# Altium schematic sheet Controller.SchDoc
size A4
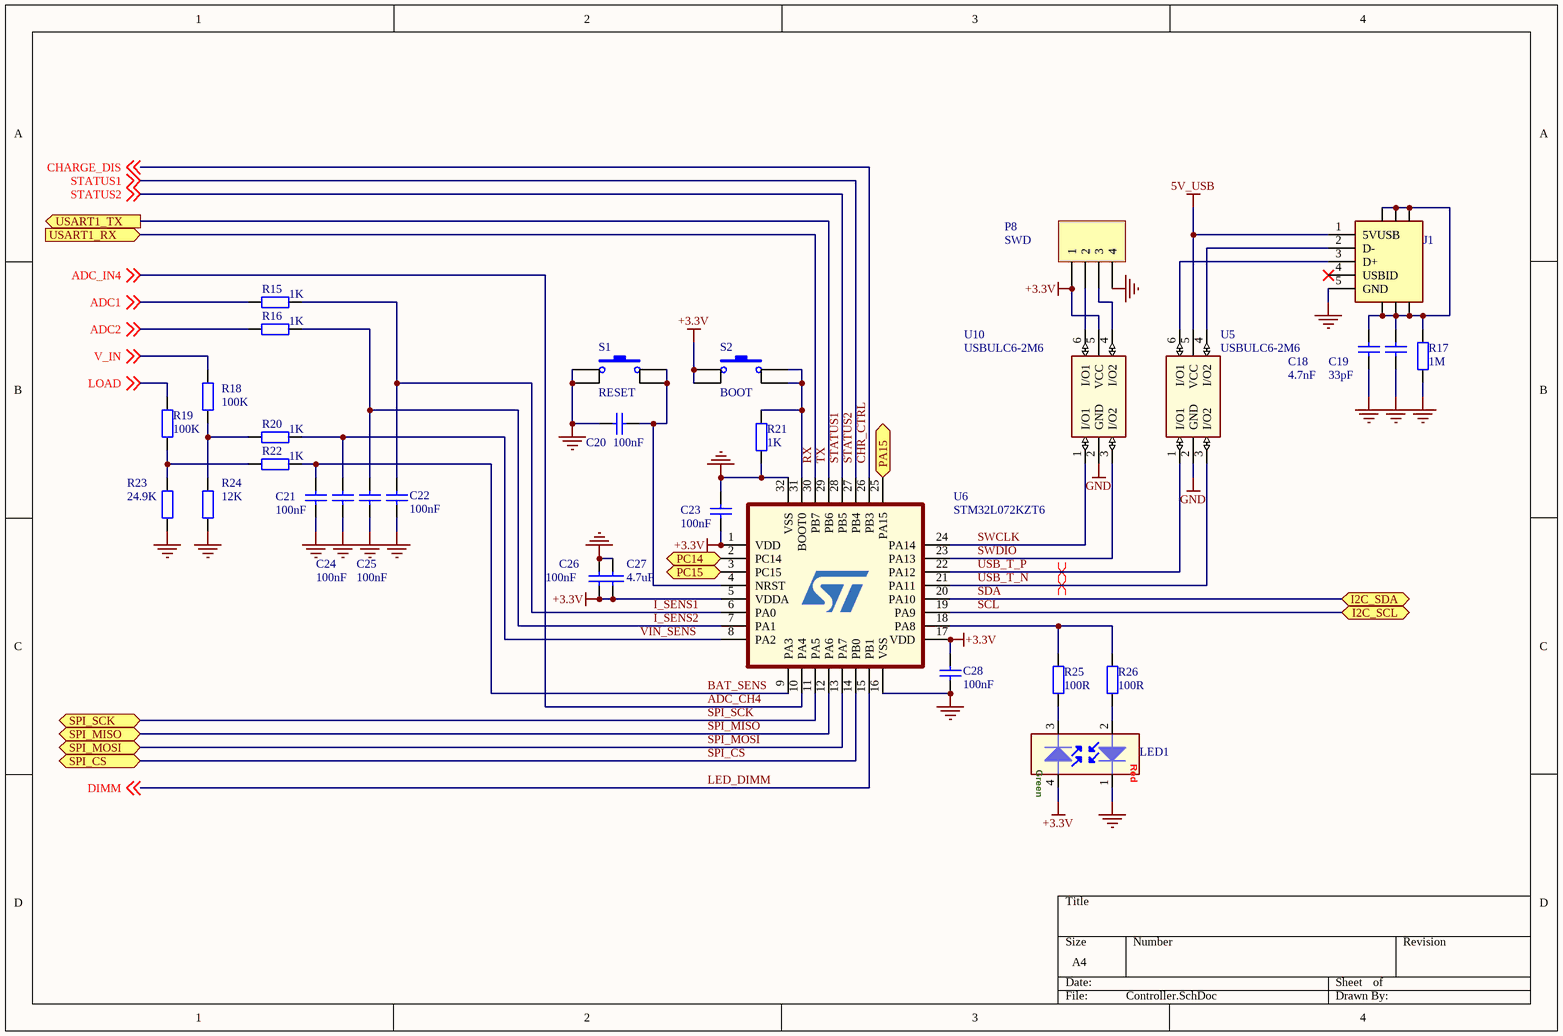
[diagram p0: Controller.SchDoc]

## Parts
C18  value 4.7nF  [C0402]  (hidden comment: Capacitor ceramic)
C19  value 33pF  [C0402]  (hidden comment: Capacitor ceramic)
C20  value 100nF  [C0402]  (hidden comment: Capacitor ceramic)
C21  value 100nF  [C0402]  (hidden comment: Capacitor ceramic)
C22  value 100nF  [C0402]  (hidden comment: Capacitor ceramic)
C23  value 100nF  [C0402]  (hidden comment: Capacitor ceramic)
C24  value 100nF  [C0402]  (hidden comment: Capacitor ceramic)
C25  value 100nF  [C0402]  (hidden comment: Capacitor ceramic)
C26  value 100nF  [C0402]  (hidden comment: Capacitor ceramic)
C27  value 4.7uF  [C0805]  (hidden comment: Capacitor ceramic)
C28  value 100nF  [C0402]  (hidden comment: Capacitor ceramic)
J1  CON-000116-01  [10118192-0001LF]  (value not drawn)
LED1  LED_BICOLOR  [PLCC-4]  (value not drawn)
P8  SWD  [HDR1X4]  (no BOM)
R15  value 1K  [R0402]  (hidden comment: Resistor)
R16  value 1K  [R0402]  (hidden comment: Resistor)
R17  value 1M  [R0402]  (hidden comment: Resistor)
R18  value 100K  [R0402]  (hidden comment: Resistor)
R19  value 100K  [R0402]  (hidden comment: Resistor)
R20  value 1K  [R0402]  (hidden comment: Resistor)
R21  value 1K  [R0402]  (hidden comment: Resistor)
R22  value 1K  [R0402]  (hidden comment: Resistor)
R23  value 24.9K  [R0402]  (hidden comment: Resistor)
R24  value 12K  [R0402]  (hidden comment: Resistor)
R25  value 100R  [R0402]  (hidden comment: Resistor)
R26  value 100R  [R0402]  (hidden comment: Resistor)
S1  RESET  [EVQPUA]
S2  BOOT  [EVQPUA]
U5  USBULC6-2M6  [Micro_QFN_6L]
U6  STM32L072KZT6  [LQFP32]
U10  USBULC6-2M6  [Micro_QFN_6L]

## Ports
I2C_SCL (bidir), I2C_SDA (bidir), PA15 (bidir), PC14 (bidir), PC15 (bidir), SPI_CS (bidir), SPI_MISO (bidir), SPI_MOSI (bidir), SPI_SCK (bidir), USART1_RX (in), USART1_TX (out)

## Nets
5V_USB: J1.1(5VUSB) U5.5(VCC)
+3.3V: C23.2 C26.2 C27.1 C28.1 LED1.4 P8.1 S2.1 S2.3 U6.1(VDD) U6.5(VDDA) U6.17(VDD) U10.5(VCC)
GND: C18.1 C19.1 C20.2 C21.2 C22.2 C23.1 C24.2 C25.2 C26.1 C27.2 C28.2 J1.5(GND) LED1.1 P8.4 R17.1 R21.1 R23.2 R24.1 S1.1 S1.3 U5.2(GND) U6.16(VSS) U6.32(VSS) U10.2(GND)
ADC1: R15.1 ; off-sheet ADC1
ADC2: R16.1 ; off-sheet ADC2
ADC_CH4: U6.10(PA4) ; off-sheet ADC_IN4  [also labelled ADC_IN4]
BAT_SENS: C21.1 R22.2 U6.9(PA3)
CHR_CTRL: U6.26(PB3) ; off-sheet CHARGE_DIS  [also labelled CHARGE_DIS]
I_SENS1: C22.1 R15.2 U6.6(PA0)
I_SENS2: C25.1 R16.2 U6.7(PA1)
LED_DIMM: U6.15(PB1) ; off-sheet DIMM  [also labelled DIMM]
LOAD: R19.1 ; off-sheet LOAD
PA15: U6.25(PA15) ; port PA15
PC14: U6.2(PC14) ; port PC14
PC15: U6.3(PC15) ; port PC15
RX: U6.30(PB7) ; port USART1_RX
SCL: U6.19(PA9) ; port I2C_SCL
SDA: U6.20(PA10) ; port I2C_SDA
SPI_CS: U6.14(PB0) ; port SPI_CS
SPI_MISO: U6.12(PA6) ; port SPI_MISO
SPI_MOSI: U6.13(PA7) ; port SPI_MOSI
SPI_SCK: U6.11(PA5) ; port SPI_SCK
STATUS1: U6.27(PB4) U6.28(PB5) ; off-sheet STATUS1, off-sheet STATUS2  [also labelled STATUS2]
SWCLK: U6.24(PA14) U10.1(I/O1)
SWDIO: U6.23(PA13) U10.3(I/O2)
TX: U6.29(PB6) ; port USART1_TX
USB_T_N: U5.3(I/O2) U6.21(PA11)
USB_T_P: U5.1(I/O1) U6.22(PA12)
V_IN: R18.2 ; off-sheet V_IN
VIN_SENS: C24.1 R20.2 U6.8(PA2)
NetC18_2: C18.2 C19.2 J1.6 J1.7 J1.8 J1.9 J1.10 J1.11 R17.2
NetC20_1: C20.1 S1.2 S1.4 U6.4(NRST)
NetJ1_2: J1.2(D-) U5.4(I/O2)
NetJ1_3: J1.3(D+) U5.6(I/O1)
NetLED1_2: LED1.2 R26.2
NetLED1_3: LED1.3 R25.2
NetP8_2: P8.2 U10.6(I/O1)
NetP8_3: P8.3 U10.4(I/O2)
NetR18_1: R18.1 R20.1 R24.2
NetR19_2: R19.2 R22.1 R23.1
NetR21_2: R21.2 S2.2 S2.4 U6.31(BOOT0)
NetR25_1: R25.1 R26.1 U6.18(PA8)

Not connected (* = marked no-connect by the designer): J1 4(USBID)*

## Layout directives
differential pair: USB_T_N, USB_T_P

## Notes on the sheet
- (in symbol LED_BICOLOR) Red; Green

## Library data of the parts
C18 = Cap Semi: Manufacturer: Yageo; Manufacturer Part No.: AC0402KRX7R9BB472; Part Description: Ceramic Capacitor; Specification: X7R, 50V, 10%; Supplier: DigiKey; Supplier part number: 311-3030-1-ND; Link: https://www.digikey.com/product-detail/en/yageo/AC0402KRX7R9BB472/311-3030-1-ND/6643281
C19 = Cap Semi: Manufacturer: Yageo; Manufacturer Part No.: CC0402JRNPO9BN330; Part Description: Ceramic Capacitor; Specification: NP0, 50V, 5%; Supplier: DigiKey; Supplier part number: 311-1020-1-ND; Link: https://www.digikey.com/product-detail/en/yageo/CC0402JRNPO9BN330/311-1020-1-ND/302937
C20 = Cap Semi: Manufacturer: TDK Corporation; Manufacturer Part No.: CGA2B3X7R1V104K050BB; Part Description: Ceramic Capacitor; Specification: X7R, 35V, 10%; Supplier: DigiKey; Supplier part number: 445-6901-1-ND; Link: https://www.digikey.com/product-detail/en/tdk-corporation/CGA2B3X7R1V104K050BB/445-6901-1-ND/2672919
C21-C26 C28 = Cap: Manufacturer: TDK Corporation; Manufacturer Part No.: CGA2B3X7R1V104K050BB; Part Description: Ceramic Capacitor; Specification: X7R, 35V, 10%; Link: https://www.digikey.com/product-detail/en/tdk-corporation/CGA2B3X7R1V104K050BB/445-6901-1-ND/2672919; Supplier: DigiKey; Supplier part number: 445-6901-1-ND
C27 = Cap Semi: Manufacturer: Murata Electronics; Manufacturer Part No.: GRM219R6YA475KA73D; Part Description: Ceramic Capacitor; Specification: X5R, 35V, 10%; Supplier: DigiKey; Supplier part number: 490-7208-1-ND; Link: https://www.digikey.com/product-detail/en/murata-electronics/GRM219R6YA475KA73D/490-7208-1-ND/3900454
J1 = CON-000116-01: Manufacturer: Amphenol ICC (FCI); Part Description: Micro USB Connector; Specification: Type B; Value: 10118192-0001LF; Manufacturer Part No.: 10118192-0001LF; Supplier: DigiKey; Supplier part number: 609-4613-1-ND; Link: https://www.digikey.com/product-detail/en/amphenol-icc-fci/10118192-0001LF/609-4613-1-ND/2785378
LED1 = LED_BICOLOR: Manufacturer: OSRAM Opto Semiconductors Inc.; Manufacturer Part No.: LSG T67K-JL-1+HK-1; Part Description: BICOLOR LED RED/GREEN CLEAR; Specification: SMT; Value: LSG T67K-JL-1+HK-1; Link: https://www.digikey.com/product-detail/en/osram-opto-semiconductors-inc/LSG-T67K-JL-1-HK-1/475-3435-1-ND/7908051; Supplier: DigiKey; Supplier part number: 475-3435-1-ND
P8 = Header 4: Header, 4-Pin; Manufacturer: Samtec Inc.; Manufacturer Part No.: SLW-104-01-G-S; Part Description: Receptacle Connector Through Hole; Specification: 4 pos. 2.54mm; Value: SLW-104-01-G-S; Link: https://www.digikey.com/products/en?keywords=SLW-104-01-G-S; Supplier: DigiKey; Supplier part number: SAM1089-04-ND
R15 R16 R20-R22 = Res2: Manufacturer: Yageo; Manufacturer Part No.: AC0402JR-071KL; Part Description: Thick Film Resistor; Specification: 5% 0,063W; Link: https://www.digikey.com/product-detail/en/yageo/AC0402JR-071KL/YAG3525CT-ND/6006374; Supplier: DigiKey; Supplier part number: YAG3525CT-ND
R17 = Res2: Manufacturer: Yageo; Manufacturer Part No.: RC0402FR-071ML; Part Description: Thick Film Resistor; Specification: 1% 0,063W; Supplier: DigiKey; Supplier part number: 311-1.00MLRCT-ND; Link: https://www.digikey.com/product-detail/en/yageo/RC0402FR-071ML/311-1-00MLRCT-ND/729462
R18 R19 = Res2: Manufacturer: Yageo; Manufacturer Part No.: RC0402JR-07100KL; Part Description: Thick Film Resistor; Specification: 5% 0,063W; Link: https://www.digikey.com/product-detail/en/yageo/RC0402JR-07100KL/311-100KJRCT-ND/729363; Supplier: DigiKey; Supplier part number: 311-100KJRCT-ND
R23 = Res2: Manufacturer: Yageo; Manufacturer Part No.: RC0402FR-0724K9L; Part Description: Thick Film Resistor; Specification: 1% 0,063W; Link: https://www.digikey.com/product-detail/en/yageo/RC0402FR-0724K9L/311-24-9KLRCT-ND/729514; Supplier: DigiKey; Supplier part number: 311-24.9KLRCT-ND
R24 = Res2: Manufacturer: Yageo; Manufacturer Part No.: RC0402JR-0712KL; Part Description: Thick Film Resistor; Specification: 5% 0,063W; Link: https://www.digikey.com/product-detail/en/yageo/RC0402JR-0712KL/311-12KJRCT-ND/729370; Supplier: DigiKey; Supplier part number: 311-12KJRCT-ND
R25 R26 = Res2: Manufacturer: Yageo; Manufacturer Part No.: SR0402JR-7W100RL; Part Description: Thick Film Resistor; Specification: 5% 0.125W; Supplier: DigiKey; Supplier part number: YAG6156CT-ND; Link: https://www.digikey.com/product-detail/en/yageo/SR0402JR-7W100RL/YAG6156CT-ND/9696610
S1 S2 = SW-PB: Switch; Manufacturer: Panasonic; Manufacturer Part No.: EVQPUJ02K; Part Description: Tactile Button; Specification: 1.6N, Right Angle, 50mA; Value: EVQPUJ02K; Supplier: DigiKey; Supplier part number: P10851SCT-ND; Link: https://www.digikey.com/product-detail/en/panasonic-electronic-components/EVQ-PUJ02K/P10851SCT-ND/286352
U5 U10 = USBULC6-2M6: Ultra large bandwidth ESD protection; Manufacturer: STMicroelectronics; Specification: 6V, 0.6pF; Link: https://www.digikey.com/product-detail/en/stmicroelectronics/USBULC6-2M6/497-7044-1-ND/1880382; Manufacturer Part No.: USBULC6-2M6; Part Description: Ultra large bandwidth ESD protection; Supplier: DigiKey; Supplier part number: 497-7044-1-ND; Value: USBULC6-2M6
U6 = STM32L072KZT6: Ultra-low-power 32-bit MCU Arm®-based Cortex®-M0+; Manufacturer: STMicroelectronics; Specification: 192KB, 20KB, 1.65V-3.6V; Link: https://www.digikey.com/products/en?keywords=STM32L072KZT6; Manufacturer Part No.: STM32L072KZT6; Part Description: Ultra-low-power 32-bit MCU Arm®-based Cortex®-M0+; Supplier: DigiKey; Supplier part number: 497-19668-ND; Value: STM32L072KZT6